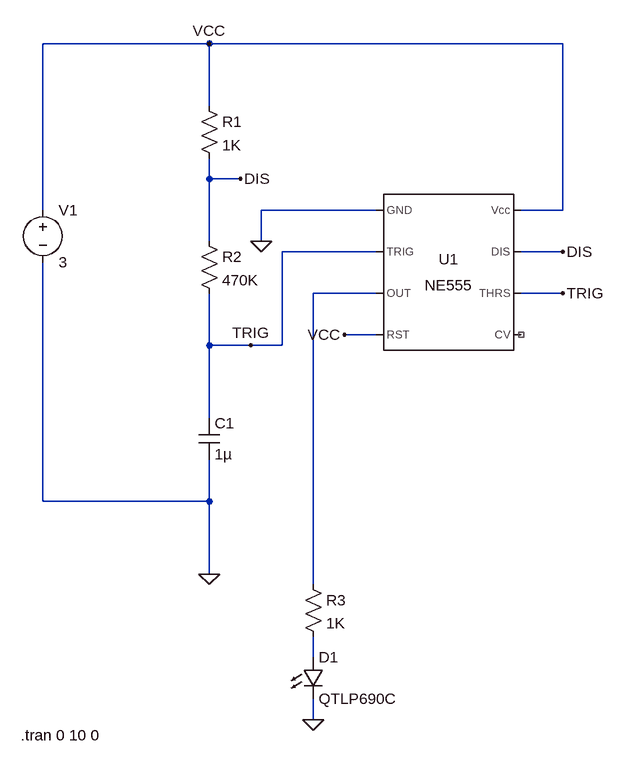
[diagram p0: schematic Simulation.asc]
Simulation.asc, the LTspice schematic file:
Version 4
SHEET 1 880 888
WIRE -144 -192 -400 -192
WIRE 400 -192 -144 -192
WIRE -144 -96 -144 -192
WIRE -144 16 -144 -16
WIRE -96 16 -144 16
WIRE -400 64 -400 -192
WIRE 112 64 -64 64
WIRE 400 64 400 -192
WIRE 400 64 336 64
WIRE -144 112 -144 16
WIRE -64 112 -64 64
WIRE 112 128 -32 128
WIRE 400 128 336 128
WIRE 112 192 16 192
WIRE 400 192 336 192
WIRE 112 256 64 256
WIRE -144 272 -144 192
WIRE -80 272 -144 272
WIRE -32 272 -32 128
WIRE -32 272 -80 272
WIRE -144 384 -144 272
WIRE -400 512 -400 144
WIRE -144 512 -144 448
WIRE -144 512 -400 512
WIRE -144 624 -144 512
WIRE 16 640 16 192
WIRE 16 752 16 720
WIRE 16 848 16 816
FLAG -144 624 0
FLAG 16 848 0
FLAG 400 128 DIS
FLAG 64 256 VCC
FLAG 400 192 TRIG
FLAG -80 272 TRIG
FLAG -64 112 0
FLAG -144 -192 VCC
FLAG -96 16 DIS
SYMBOL Misc\\NE555 224 160 R0
SYMATTR InstName U1
SYMBOL res -160 -112 R0
SYMATTR InstName R1
SYMATTR Value 1K
SYMBOL res -160 96 R0
SYMATTR InstName R2
SYMATTR Value 470K
SYMBOL cap -160 384 R0
SYMATTR InstName C1
SYMATTR Value 1µ
SYMBOL voltage -400 48 R0
WINDOW 123 0 0 Left 2
WINDOW 39 0 0 Left 2
SYMATTR InstName V1
SYMATTR Value 3
SYMBOL res 0 624 R0
SYMATTR InstName R3
SYMATTR Value 1K
SYMBOL LED 0 752 R0
SYMATTR InstName D1
SYMATTR Value QTLP690C
TEXT -434 872 Left 2 !.tran 0 10 0

The netlist it stands for:
* Simulation.asc
XU1 0 TRIG N001 VCC NC_01 TRIG DIS VCC NE555  ; pins GND TRIG OUT RST CV THRS DIS Vcc
R1 VCC DIS 1K
R2 DIS TRIG 470K
C1 TRIG 0 1µ
V1 VCC 0 3
R3 N001 N002 1K
D1 N002 0 QTLP690C
.model D D
.lib standard.dio
.tran 0 10 0
.lib NE555.sub
.backanno
.end